# Altium schematic sheet Controller.SchDoc: Controller Section
size 420 x 297 mm; SheetNumber: 2
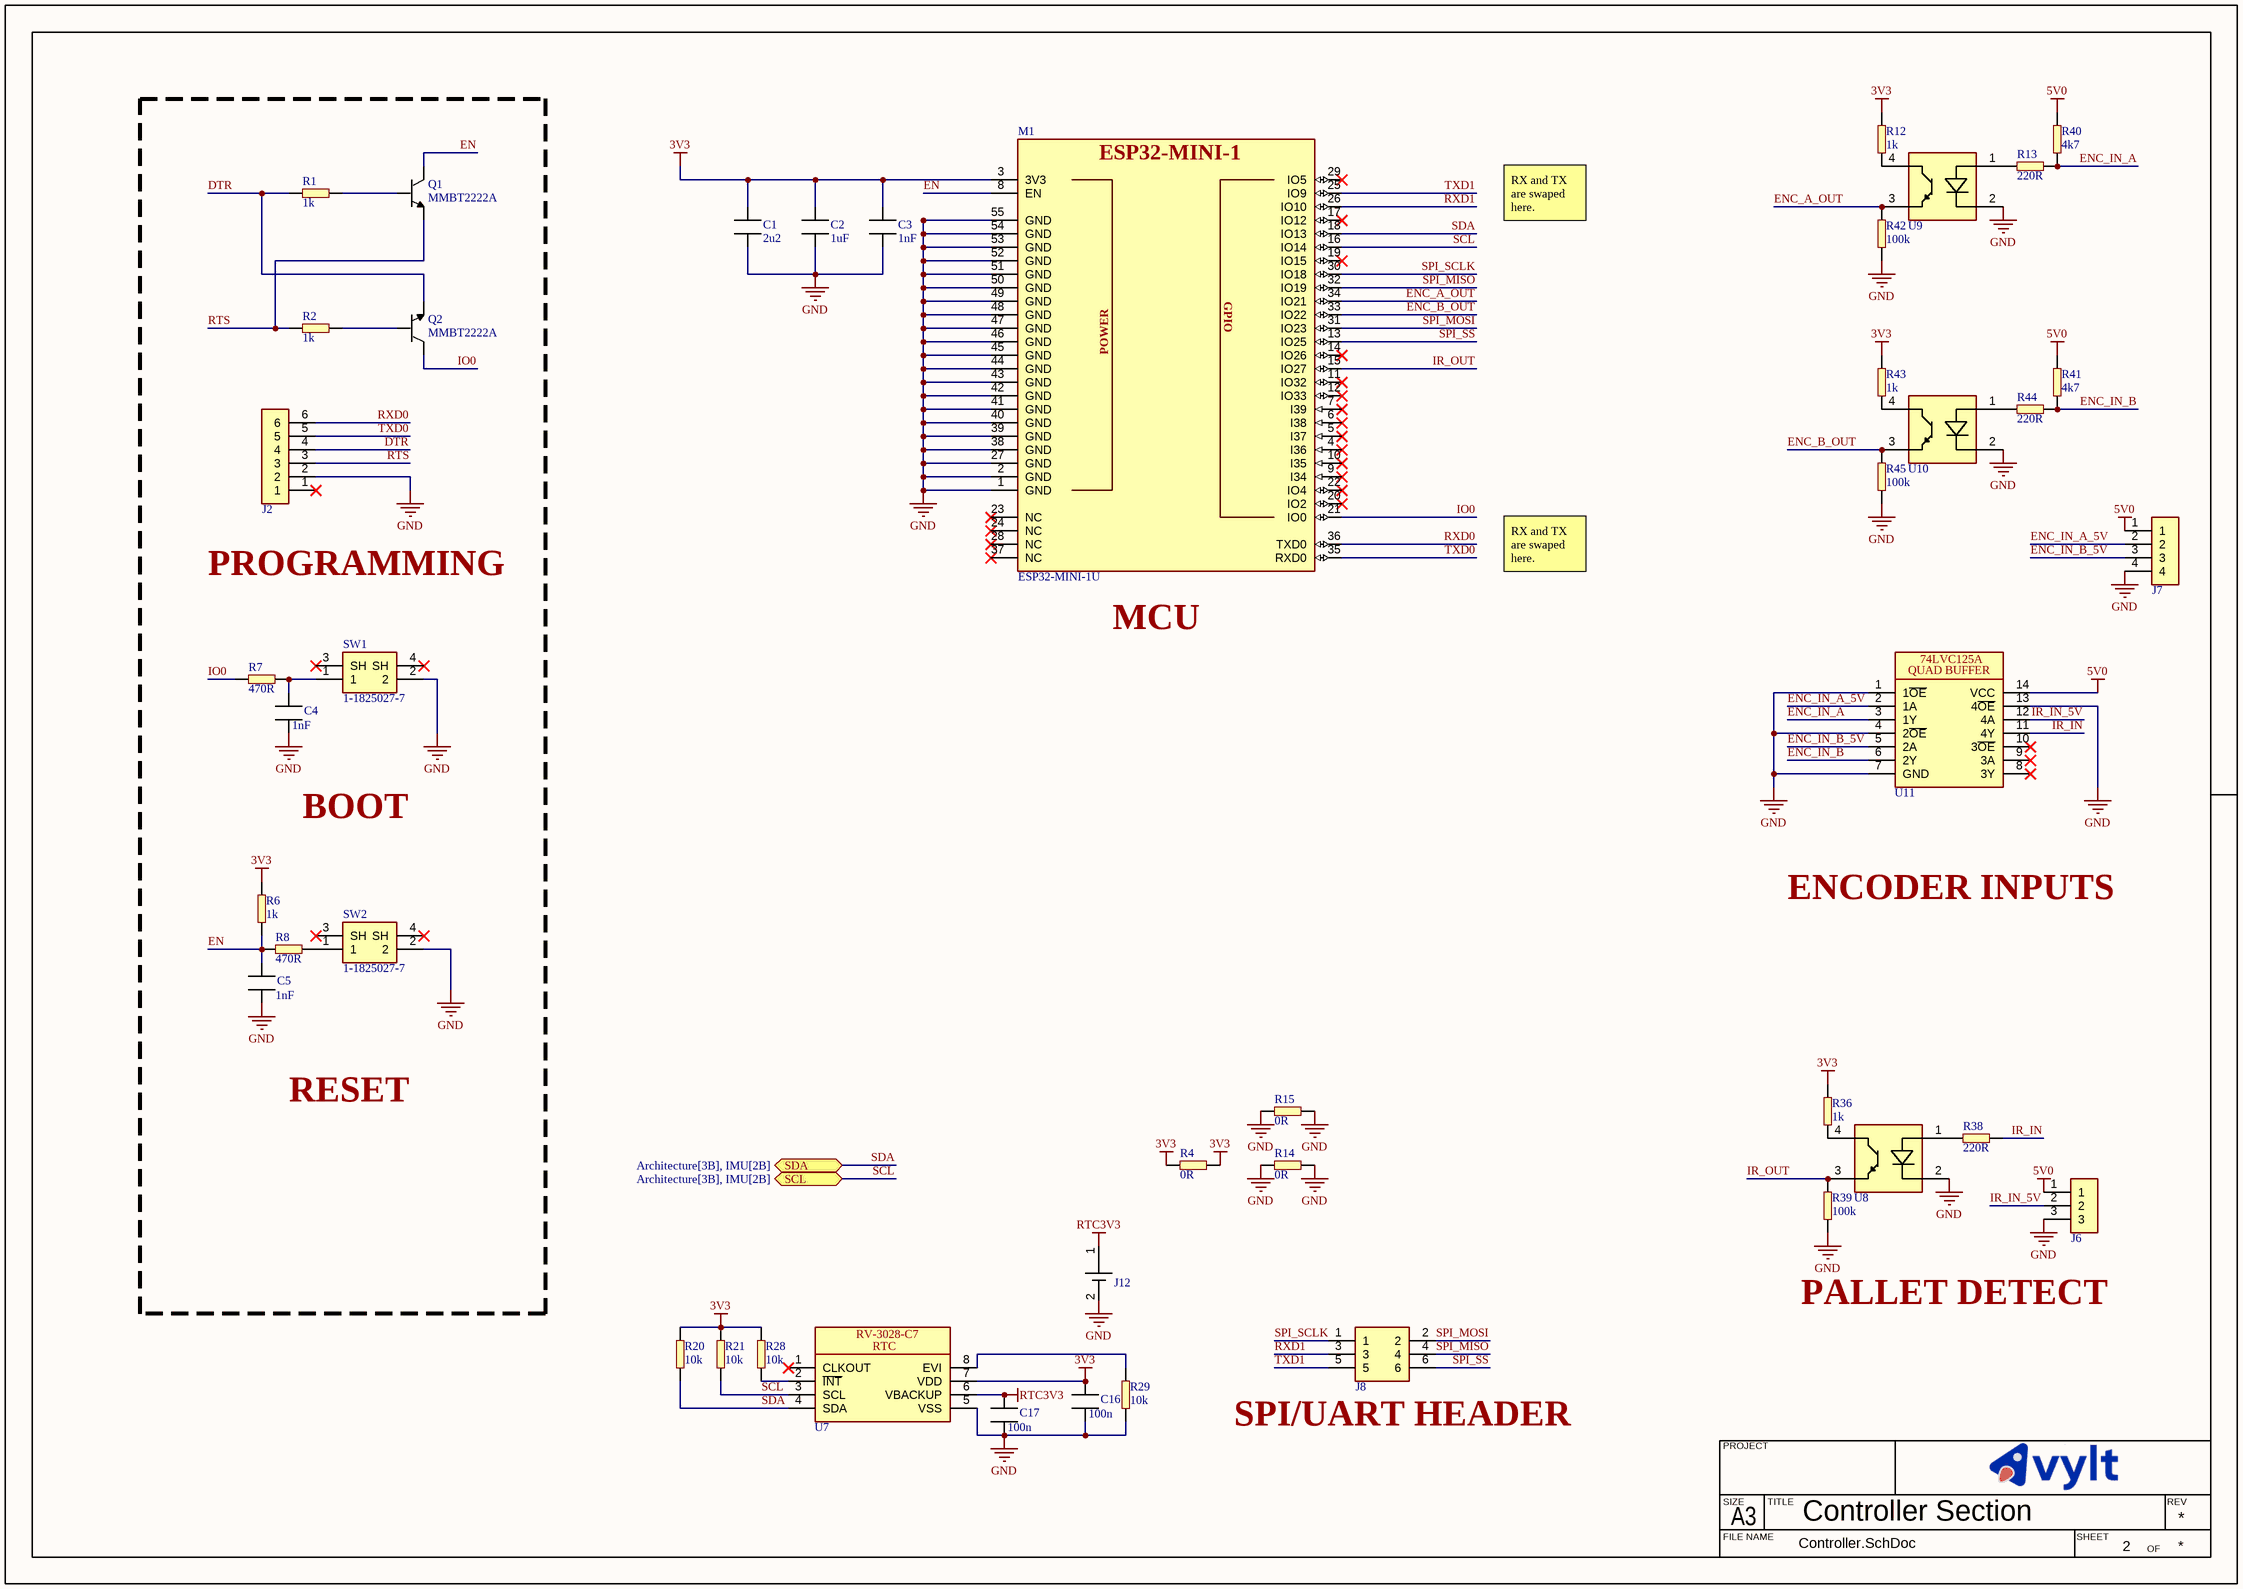
[diagram p0: Controller.SchDoc]

## Parts
C1  value 2u2  [CAPC1608X10N]  (hidden comment: ERP_102-1)
C2  value 1uF  [CAPC1608X10N]  (hidden comment: ERP_102-1)
C3  value 1nF  [CAPC1608X10N]  (hidden comment: ERP_102-1)
C4  value 1nF  [CAPC1608X10N]  (hidden comment: ERP_102-1)
C5  value 1nF  [CAPC1608X10N]  (hidden comment: ERP_102-1)
C16  value 100n  [CAPC1608X10N]  (hidden comment: ERP_102-1)
C17  value 100n  [CAPC1608X10N]  (hidden comment: ERP_102-1)
J2  ERP_148-2  [6PX1R]  (value not drawn)  (no BOM)
J6  Terminal_Block_3Pin_2.54P  [Terminal_Block_3Pin_2.54P]  (value not drawn)
J7  Terminal_Block_4Pin_2.54P  [Terminal_Block_4Pin_2.54P]  (value not drawn)
J8  6X2_1P27_MH_TH  [6X2_1P27_MH_TH]  (value not drawn)  (no BOM)
J12  CR1220-BH  [CR1220-BH]  (value not drawn)
M1  value ESP32-MINI-1U  [ESP32_MINI_1U]  (hidden comment: ERP_140-3)
Q1  value MMBT2222A  [MMBT2222]  (hidden comment: ERP_105-1)
Q2  value MMBT2222A  [MMBT2222]  (hidden comment: ERP_105-1)
R1  value 1k  [RES_0603]  (hidden comment: ERP_101-1)
R2  value 1k  [RES_0603]  (hidden comment: ERP_101-1)
R4  value 0R  [RESC3115X06N]  (hidden comment: ERP_101-1)
R6  value 1k  [RES_0603]  (hidden comment: ERP_101-1)
R7  value 470R  [RES_0603]  (hidden comment: ERP_101-1)
R8  value 470R  [RES_0603]  (hidden comment: ERP_101-1)
R12  value 1k  [RES_0603]  (hidden comment: ERP_101-1)
R13  value 220R  [RES_0603]  (hidden comment: ERP_101-1)
R14  value 0R  [RESC3115X06N]  (hidden comment: ERP_101-1)
R15  value 0R  [RESC3115X06N]  (hidden comment: ERP_101-1)
R20  value 10k  [RES_0603]  (hidden comment: ERP_101-1)
R21  value 10k  [RES_0603]  (hidden comment: ERP_101-1)
R28  value 10k  [RES_0603]  (hidden comment: ERP_101-1)
R29  value 10k  [RES_0603]  (hidden comment: ERP_101-1)
R36  value 1k  [RES_0603]  (hidden comment: ERP_101-1)
R38  value 220R  [RES_0603]  (hidden comment: ERP_101-1)
R39  value 100k  [RES_0603]  (hidden comment: ERP_101-1)
R40  value 4k7  [RES_0603]  (hidden comment: ERP_101-1)
R41  value 4k7  [RES_0603]  (hidden comment: ERP_101-1)
R42  value 100k  [RES_0603]  (hidden comment: ERP_101-1)
R43  value 1k  [RES_0603]  (hidden comment: ERP_101-1)
R44  value 220R  [RES_0603]  (hidden comment: ERP_101-1)
R45  value 100k  [RES_0603]  (hidden comment: ERP_101-1)
SW1  value 1-1825027-7  [FSM_6X6]  (hidden comment: ERP_110-4)
SW2  value 1-1825027-7  [FSM_6X6]  (hidden comment: ERP_110-4)
U7  RV-3028-C7  [RV-3028-C7]  (value not drawn)
U8  FOD817A3SD  [FOD817A3SD]  (value not drawn)
U9  FOD817A3SD  [FOD817A3SD]  (value not drawn)
U10  FOD817A3SD  [FOD817A3SD]  (value not drawn)
U11  74LVC125ABQ  [74LVC125ABQ]  (value not drawn)

## Ports
SCL (bidir, see Architecture[3B], IMU[2B]), SDA (bidir, see Architecture[3B], IMU[2B])

## Nets
3V3: C1.2 C2.2 C3.2 C16.1 M1.3(3V3) R4.1 R4.2 R6.2 R12.2 R20.2 R21.2 R28.2 R36.2 R43.2 U7.7(VDD)
5V0: J6.1 J7.1 R40.2 R41.2 U11.14(VCC)
GND: C1.1 C2.1 C3.1 C4.2 C5.2 C16.2 C17.2 J2.2 J6.3 J7.4 J12.2(-) M1.1(GND) M1.2(GND) M1.27(GND) M1.38(GND) M1.39(GND) M1.40(GND) M1.41(GND) M1.42(GND) M1.43(GND) M1.44(GND) M1.45(GND) M1.46(GND) M1.47(GND) M1.48(GND) M1.49(GND) M1.50(GND) M1.51(GND) M1.52(GND) M1.53(GND) M1.54(GND) M1.55(GND) R14.1 R14.2 R15.1 R15.2 R29.1 R39.1 R42.1 R45.1 SW1.2 SW2.2 U7.5(VSS) U8.2(CATHODE) U9.2(CATHODE) U10.2(CATHODE) U11.1(1~{OE}) U11.4(2~{OE}) U11.7(GND) U11.13(4~{OE})
RTC3V3: C17.1 J12.1(+) U7.6(VBACKUP)
DTR: J2.4 Q2.2 R1.2
EN: C5.1 M1.8(EN) Q1.3 R6.1 R8.2
ENC_A_OUT: M1.34(IO21) R42.2 U9.3(EMITTER)
ENC_B_OUT: M1.33(IO22) R45.2 U10.3(EMITTER)
ENC_IN_A: R13.2 R40.1 U11.3(1Y)
ENC_IN_A_5V: J7.2 U11.2(1A)
ENC_IN_B: R41.1 R44.2 U11.6(2Y)
ENC_IN_B_5V: J7.3 U11.5(2A)
IO0: M1.21(IO0) Q2.3 R7.2
IR_IN: R38.2 U11.11(4Y)
IR_IN_5V: J6.2 U11.12(4A)
IR_OUT: M1.15(IO27) R39.2 U8.3(EMITTER)
RTS: J2.3 Q1.2 R2.2
RXD0: J2.6 M1.36(TXD0)
RXD1: J8.3 M1.26(IO10)
SCL: M1.16(IO14) R21.1 U7.3(SCL) ; port SCL
SDA: M1.18(IO13) R20.1 U7.4(SDA) ; port SDA
SPI_MISO: J8.4 M1.32(IO19)
SPI_MOSI: J8.2 M1.31(IO23)
SPI_SCLK: J8.1 M1.30(IO18)
SPI_SS: J8.6 M1.13(IO25)
TXD0: J2.5 M1.35(RXD0)
TXD1: J8.5 M1.25(IO9)
NetC4_1: C4.1 R7.1 SW1.1
NetQ1_1: Q1.1 R1.1
NetQ2_1: Q2.1 R2.1
NetR8_1: R8.1 SW2.1
NetR12_1: R12.1 U9.4(COLLECTOR)
NetR13_1: R13.1 U9.1(ANODE)
NetR28_1: R28.1 U7.2(~{INT})
NetR29_2: R29.2 U7.8(EVI)
NetR36_1: R36.1 U8.4(COLLECTOR)
NetR38_1: R38.1 U8.1(ANODE)
NetR43_1: R43.1 U10.4(COLLECTOR)
NetR44_1: R44.1 U10.1(ANODE)

Not connected (* = marked no-connect by the designer): J2 1*; M1 4(I36)* 5(I37)* 6(I38)* 7(I39)* 9(I34)* 10(I35)* 11(IO32)* 12(IO33)* 14(IO26)* 17(IO12)* 19(IO15)* 20(IO2)* 22(IO4)* 23(NC)* 24(NC)* 28(NC)* 29(IO5)* 37(NC)*; SW1 3(SH)* 4(SH)*; SW2 3(SH)* 4(SH)*; U7 1(CLKOUT)*; U11 8(3Y)* 9(3A)* 10(3~{OE})*

## Notes on the sheet
- RX and TX are swaped here.
- PROGRAMMING
- (near M1) MCU
- BOOT
- ENCODER INPUTS
- RESET
- PALLET DETECT
- (near J8) SPI/UART HEADER
- PROJECT
- SIZE
- FILE NAME
- A3
- TITLE
- SHEET
- OF
- REV
- (in symbol 74LVC125ABQ) 74LVC125A; QUAD BUFFER
- (in symbol ESP32_MINI_1) ESP32-MINI-1; GPIO; POWER
- (in symbol RV-3028-C7) RTC

## Library data of the parts
C1 = MLCC_0603: MLCC 0603; Manufacturer 1: Murata Electronics; Manufacturer Part Number 1: GRT188R61H225KE13D; Package: 0603; Suuplier Part Number 1: *; ERP: *; Supplier 1: Digikey; Supplier Part Number 1: 490-12332-1-ND
C2 = MLCC_0603: MLCC 0603; Manufacturer 1: Samsung Electro-Mechanics; Manufacturer Part Number 1: CL10A105KB8NNNC; Package: 0603; Supplier 1: *; Suuplier Part Number 1: *; ERP: *
C3-C5 = MLCC_0603: MLCC 0603; Manufacturer 1: Samsung Electro-Mechanics; Manufacturer Part Number 1: CL10C102JB8NNNC; Package: 0603; Suuplier Part Number 1: *; ERP: *; Supplier 1: Digikey; Supplier Part Number 1: 1276-1091-1-ND
C16 C17 = MLCC_0603: MLCC 0603; Package: 0603; Manufacturer Part Number 1: *; Suuplier Part Number 1: *; ERP: *
  C17: Manufacturer 1: *
J2 = 6PX1R
J6 = Terminal_Block_3Pin_2.54P: TERMINAL BLOCK 3 PIN 2.54 PITCH; Manufacturer Part Number 1: *; Manufacturer 1: *; Value: *
J7 = Terminal_Block_4Pin_2.54P: TERMINAL BLOCK 4 PIN 2.54 PITCH; Manufacturer Part Number 1: *; Manufacturer 1: *; Value: *
J8 = 6X2_1P27_MH_TH: Manufacturer Part Number 1: HPH2-A-06-UA; Manufacturer 1: Adam Tech; Value: *
J12 = CR1220-BH: BATTERY HOLDER COIN 12.5MM SMD; Manufacturer 1: Keystone Electronics; Value: *; Manufacturer Part Number 1: *
M1 = ESP32_MINI_1: ESP32_C3_MINI_1 Module; Manufacturer Part Number 1: ESP32-MINI-1U-N4; Manufacturer 1: Espressif Systems; ERP: *; Package: 56 PIN SMD; Supplier 1: Digikey; Supplier Part Number 1: 1965-ESP32-MINI-1U-N4CT-ND
Q1 Q2 = MMBT2222: MMBT2222A; Manufacturer Part Number 1: MMBT2222A-7-F; Manufacturer 1: Diotec Semiconductor; ERP: *; Suuplier Part Number 1: *; Supplier 1: *; Package: SOT23
R1 R2 R6 R12 R13 R36 R38 R40 R41 R43 R44 = RES_0603: Manufacturer 1: YAGEO; Manufacturer Part Number 1: RC0603FR-071KL; Package: 0603; ERP: *
R4 R14 R15 = RES_1206: Package: 1206; Manufacturer 1: *; Manufacturer Part Number 1: *; Supplier  1: *; Supplier  Part Number 1: *; ERP: *
R7 R8 = RES_0603: Manufacturer 1: YAGEO; Manufacturer Part Number 1: RC0603JR-07470RL; Package: 0603; ERP: *; Supplier 1: *; Supplier Part Number 1: *; Supplier 2: Digikey; Supplier Part Number 2: 311-470GRCT-ND
R20 R21 R28 R29 R39 = RES_0603: Package: 0603; Manufacturer 1: *; Manufacturer Part Number 1: *; ERP: *
  R20 R21 R28 R29: Supplier 1: *; Supplier Part Number 1: *
R42 R45 = RES_0603: Manufacturer Part Number 1: RC0603FR-07100KL; Package: 0603; Manufacturer 1: *; ERP: *
SW1 SW2 = FSM_6X6: Manufacturer 1: TE; ERP: *; Suuplier Part Number 1: *; Manufacturer Part Number 1: 1-1825027-7; Package: 6X6; Supplier 1: Digikey; Supplier Part Number 1: 450-1660-ND
U7 = RV-3028-C7: IC RTC CLK/CALENDAR I2C 8SON; Manufacturer 1: Micro Crystal AG; Manufacturer Part Number 1: RV-3028-C7 32.768KHZ 1PPM-TA-QC; Value: *
U8-U10 = FOD817A3SD: OPTOISOLATOR 5KV TRANSISTOR 4SMD; Manufacturer: onsemi; Value: *; Manufacturer Part Number 1: FOD817A3SD
U11 = 74LVC125ABQ: IC BUF NON-INVERT 3.6V 14DHVQFN; Manufacturer Part Number 1: 74LVC125ABQ,115; Manufacturer 1: Nexperia USA Inc.